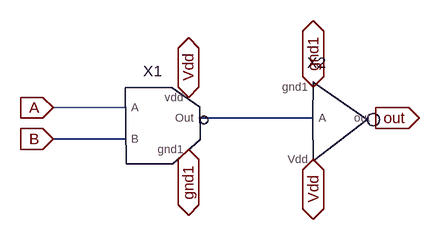
[diagram p0: schematic ANDDDDD.asc]
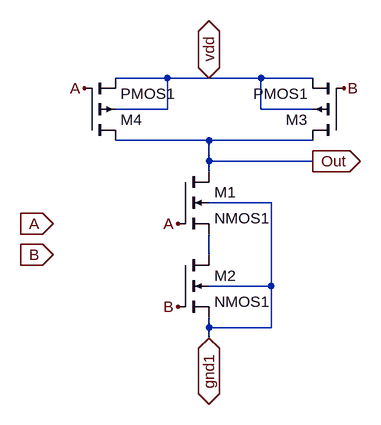
[diagram p1: sub-circuit nand.asc]
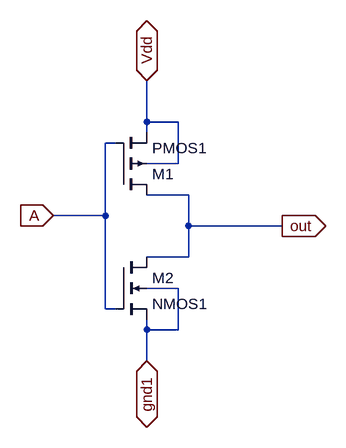
[diagram p2: sub-circuit not.asc]
ANDDDDD.asc, the LTspice schematic file:
Version 4.1
SHEET 1 880 680
WIRE 64 160 -48 160
WIRE 352 176 176 176
WIRE 64 208 -48 208
FLAG -48 160 A
IOPIN -48 160 In
FLAG -48 208 B
IOPIN -48 208 In
FLAG 160 224 gnd1
IOPIN 160 224 BiDir
FLAG 160 144 Vdd
IOPIN 160 144 BiDir
FLAG 352 128 gnd1
IOPIN 352 128 BiDir
FLAG 352 240 Vdd
IOPIN 352 240 BiDir
FLAG 448 176 out
IOPIN 448 176 Out
SYMBOL NAND 112 192 R0
SYMATTR InstName X1
SYMBOL NOT 384 176 R0
SYMATTR InstName X2

nand.asc, the sub-circuit schematic file:
Version 4.1
SHEET 1 880 680
WIRE 176 0 96 0
WIRE 240 0 176 0
WIRE 320 0 240 0
WIRE 400 0 320 0
WIRE 176 48 176 0
WIRE 176 48 96 48
WIRE 320 48 320 0
WIRE 400 48 320 48
WIRE 240 96 96 96
WIRE 400 96 240 96
WIRE 240 128 240 96
WIRE 400 128 240 128
WIRE 240 144 240 128
WIRE 336 192 240 192
WIRE 240 272 240 240
WIRE 336 320 336 192
WIRE 336 320 240 320
WIRE 240 384 240 368
WIRE 336 384 336 320
WIRE 336 384 240 384
WIRE 240 400 240 384
FLAG 0 224 A
IOPIN 0 224 In
FLAG 0 272 B
IOPIN 0 272 In
FLAG 400 128 Out
IOPIN 400 128 Out
FLAG 240 400 gnd1
IOPIN 240 400 BiDir
FLAG 240 0 vdd
IOPIN 240 0 BiDir
FLAG 48 16 A
FLAG 192 224 A
FLAG 192 352 B
FLAG 448 16 B
SYMBOL nmos4 192 144 R0
SYMATTR InstName M1
SYMATTR Value2 l=1u w=2u
SYMATTR Value NMOS1
SYMBOL nmos4 192 272 R0
SYMATTR InstName M2
SYMATTR Value2 l=1u w=2u
SYMATTR Value NMOS1
SYMBOL pmos4 448 96 R180
SYMATTR InstName M3
SYMATTR Value2 l=1u w=2u
SYMATTR Value PMOS1
SYMBOL pmos4 48 96 M180
SYMATTR InstName M4
SYMATTR Value2 l=1u w=2u
SYMATTR Value PMOS1

not.asc, the sub-circuit schematic file:
Version 4.1
SHEET 1 880 680
WIRE 256 64 256 0
WIRE 304 64 256 64
WIRE 256 80 256 64
WIRE 208 96 192 96
WIRE 304 128 304 64
WIRE 304 128 256 128
WIRE 320 176 256 176
WIRE 192 208 192 96
WIRE 192 208 112 208
WIRE 320 224 320 176
WIRE 464 224 320 224
WIRE 320 272 320 224
WIRE 320 272 256 272
WIRE 304 320 256 320
WIRE 192 352 192 208
WIRE 208 352 192 352
WIRE 256 384 256 368
WIRE 304 384 304 320
WIRE 304 384 256 384
WIRE 256 432 256 384
FLAG 256 432 gnd1
IOPIN 256 432 BiDir
FLAG 256 0 Vdd
IOPIN 256 0 BiDir
FLAG 464 224 out
IOPIN 464 224 Out
FLAG 112 208 A
IOPIN 112 208 In
SYMBOL pmos4 208 176 M180
SYMATTR InstName M1
SYMATTR Value2 l=1u w=2u
SYMATTR Value PMOS1
SYMBOL nmos4 208 272 R0
SYMATTR InstName M2
SYMATTR Value2 l=1u w=2u
SYMATTR Value NMOS1

The netlist it stands for:
* ANDDDDD.asc
X§X1 A B gnd1 N001 Vdd nand
X§X2 N001 gnd1 out Vdd not

* block symbol definitions
.subckt nand A B gnd1 Out vdd
M1 Out A N001 gnd1 NMOS1 l=1u w=2u
M2 N001 B gnd1 gnd1 NMOS1 l=1u w=2u
M3 Out B vdd vdd PMOS1 l=1u w=2u
M4 Out A vdd vdd PMOS1 l=1u w=2u
.ends nand

.subckt not A gnd1 out Vdd
M1 out A Vdd Vdd PMOS1 l=1u w=2u
M2 out A gnd1 gnd1 NMOS1 l=1u w=2u
.ends not

.model NMOS NMOS
.model PMOS PMOS
.lib standard.mos
.backanno
.end